# EAGLE design PRSC-2101-THCFS-1V3_eagle7 (EAGLE 9.5.0)
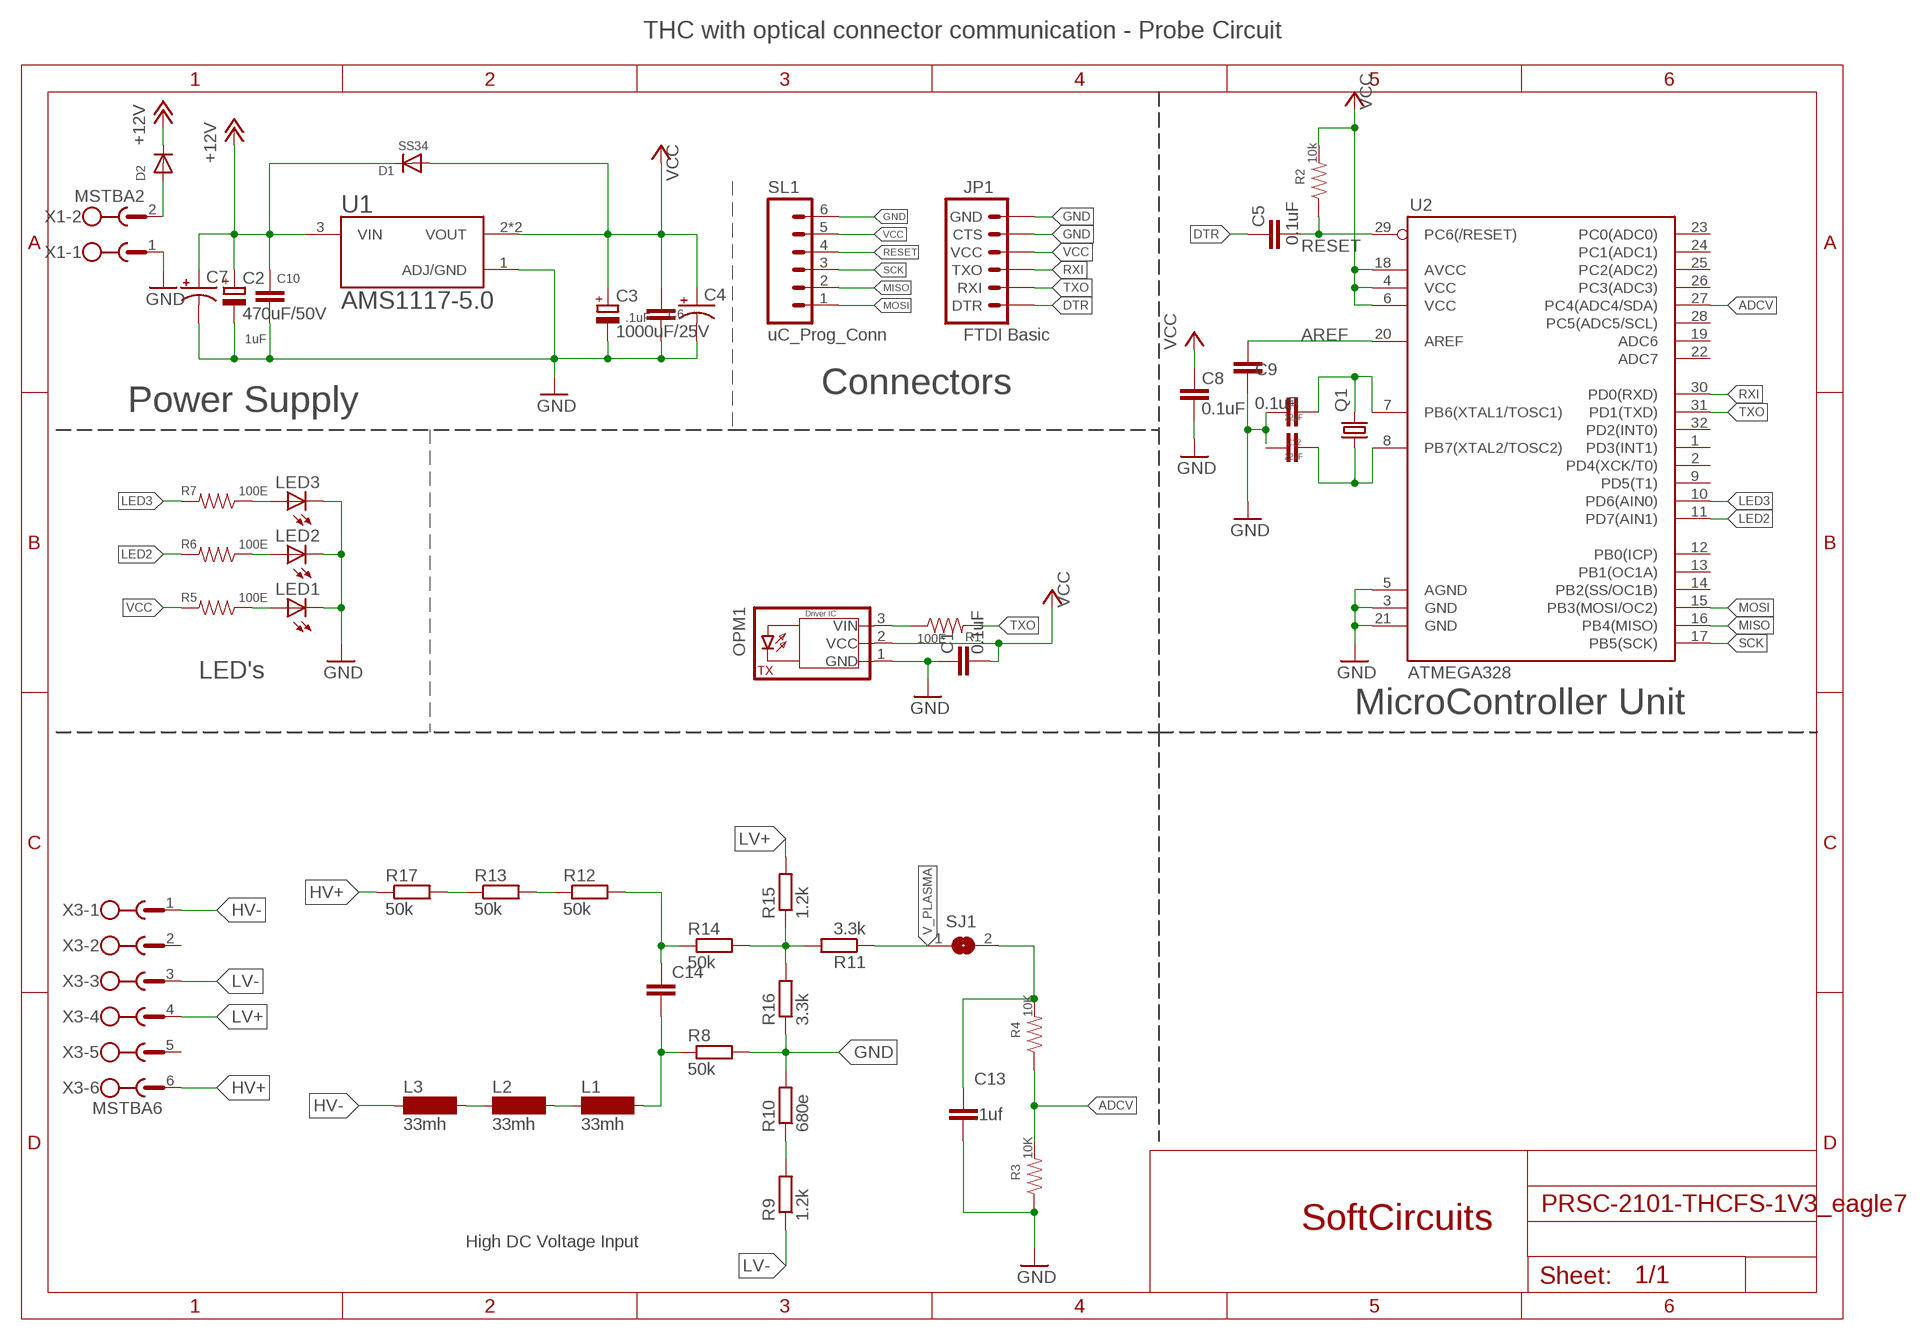
[diagram p0: schematic, sheet 1]

## Parts
C1  0.1uF  C-EUC1206  [C1206]
C2  470uF/50V  CPOL-EU153CLV-1010  [153CLV-1010]
C3  1000uF/25V  CPOL-EU153CLV-1010  [153CLV-1010]
C4  CAP_POL3528-KIT  [EIA3528-KIT]
C5  0.1uF  C-EUC1206  [C1206]
C6  .1uF  C-EUC1206  [C1206]
C7  CAP_POL3528-KIT  [EIA3528-KIT]
C8  0.1uF  C-EUC1206  [C1206]
C9  0.1uF  C-EUC1206  [C1206]
C10  1uF  C-EUC1206  [C1206]
C11  22pF  C-EUC1206  [C1206]
C12  22pF  C-EUC1206  [C1206]
C13  .1uf  C-EUC1206  [C1206]
C14  C-EU050-025X075  [C050-025X075]
D1  SS34  DIODESMA  [SMADIODE]
D2  DIODESMA  [SMADIODE]
JP1  FTDI Basic  ARDUINO_SERIAL_PROGRAMPTH  [1X06]
L1  33mh  SD12  [MY_INDUCTOR]
L2  33mh  SD12  [MY_INDUCTOR]
L3  33mh  SD12  [MY_INDUCTOR]
LED1  LED3MM  [LED3MM]
LED2  LED3MM  [LED3MM]
LED3  LED3MM  [LED3MM]
OPM1  TOSLINK_DQT-025  [TOSLINK_DQ-025]
Q1  CRYSTALHC49UP  [HC49UP]
R1  100E  RESISTOR1206  [1206]
R2  10k  RESISTOR1206  [1206]
R3  10K  RESISTOR1206  [1206]
R4  10K  RESISTOR1206  [1206]
R5  100E  RESISTOR1206  [1206]
R6  100E  RESISTOR1206  [1206]
R7  100E  RESISTOR1206  [1206]
R8  50k  R-EU_0207/5V  [0207/5V]
R9  1.2k  R-EU_0207/2V  [0207/2V]
R10  680e  R-EU_0207/5V  [0207/5V]
R11  3.3k  R-EU_0207/2V  [0207/2V]
R12  50k  R-EU_0207/5V  [0207/5V]
R13  50k  R-EU_0207/5V  [0207/5V]
R14  50k  R-EU_0207/5V  [0207/5V]
R15  1.2k  R-EU_0207/2V  [0207/2V]
R16  3.3k  R-EU_0207/15  [0207/15]
R17  50k  R-EU_0207/5V  [0207/5V]
SJ1  SJ  [SJ]
SL1  uC_Prog_Conn  M06  [06P]
U1  AMS1117-5.0  [SOT229P700X180-4N]
U2  ATMEGA328  ATMEGA168  [TQFP32-08]
X1  MSTBA2  [MSTBA2]
X3  MSTBA6  [MSTBA6]

## Nets
+12V [power]: C2.+ C7.A(+) C10.1 D1.C D2.C U1.3(VIN)
ADCV: R3.2 R4.1 U2.27(PC4(ADC4/SDA))
AREF: C9.2 U2.20(AREF)
DTR: C5.2 JP1.1(DTR)
GND: C1.2 C2.- C3.- C4.C(-) C6.2 C7.C(-) C8.1 C9.1 C10.2 C11.2 C12.2 C13.2 JP1.5(CTS) JP1.6(GND) LED1.K(C) LED2.K(C) LED3.K(C) OPM1.1(GND) R3.1 R8.2 R10.2 R16.1 SL1.6 U1.1(ADJ/GND) U2.3(GND) U2.5(AGND) U2.21(GND) X1.1
HV+: R17.1 X3.6
HV-: L3.1 X3.1
LED2: R6.2 U2.11(PD7(AIN1))
LED3: R7.2 U2.10(PD6(AIN0))
LV+: R15.2 X3.4
LV-: R9.1 X3.3
MISO: SL1.2 U2.16(PB4(MISO))
MOSI: SL1.1 U2.15(PB3(MOSI/OC2))
N$1: LED3.A R7.1
N$2: R13.1 R17.2
N$3: C14.1 R12.2 R14.1
N$4: L1.1 L2.2
N$5 [power]: D2.A X1.2
N$6: R12.1 R13.2
N$8: L2.1 L3.2
N$10: C14.2 L1.2 R8.1
N$11: OPM1.3(VIN) R1.1
N$13: R11.2 R14.2 R15.1 R16.2
N$16: C11.1 Q1.2 U2.7(PB6(XTAL1/TOSC1))
N$17: R9.2 R10.1
N$19: C12.1 Q1.1 U2.8(PB7(XTAL2/TOSC2))
N$22: LED2.A R6.1
N$23: LED1.A R5.1
PLASMA_VIN: C13.1 R4.2 SJ1.2
RESET: C5.1 R2.1 SL1.4 U2.29(PC6(/RESET))
RXI: JP1.3(TXO) U2.30(PD0(RXD))
SCK: SL1.3 U2.17(PB5(SCK))
TXO: JP1.2(RXI) R1.2 U2.31(PD1(TXD))
V_PLASMA: R11.1 SJ1.1
VCC: C1.1 C3.+ C4.A(+) C6.1 C8.2 D1.A JP1.4(VCC) OPM1.2(VCC) R2.2 R5.2 SL1.5 U1.2(VOUT) U1.4(VOUT) U2.4(VCC) U2.6(VCC) U2.18(AVCC)
Unconnected: U2.1(PD3(INT1)) U2.2(PD4(XCK/T0)) U2.9(PD5(T1)) U2.12(PB0(ICP)) U2.13(PB1(OC1A)) U2.14(PB2(SS/OC1B)) U2.19(ADC6) U2.22(ADC7) U2.23(PC0(ADC0)) U2.24(PC1(ADC1)) U2.25(PC2(ADC2)) U2.26(PC3(ADC3)) U2.28(PC5(ADC5/SCL)) U2.32(PD2(INT0)) X3.2 X3.5

## Notes on the sheet
- THC with optical connector communication - Probe Circuit
- Connectors
- Power Supply
- LED's
- MicroController Unit
- SoftCircuits
- High DC Voltage Input

## Library data of the parts
C1 C5 C6 C8-C13 = SoftCircuits-Capacitors:C-EU: CAPACITOR, European symbol; SPICEPREFIX: C
C2 C3 = SoftCircuits-Capacitors:CPOL-EU: POLARIZED CAPACITOR, European symbol; SPICEPREFIX: C
C4 C7 = SparkFun-Capacitors:CAP_POL: Capacitor Polarized These are standard SMD and PTH capacitors. Normally 10uF, 47uF, and 100uF in electrolytic and tantalum varieties. Always verify the external diameter of the through hole cap, it varies with capacity, voltage, and manufacturer. The EIA devices should be standard.
C14 = rcl:C-EU: CAPACITOR, European symbol
D1 D2 = adafruit:DIODE: Diode SMADIODE - SMA Surface Mount Package 20V 1A Schottky Diode Digikey: 641-1014-6-ND DO-1N4148 - Through Hole Small Current Diode SOD-123 20V 1 A (.5mV Vf) Schottky Diode - Digikey: MBRX120TPMSCT-ND SOD-323 10V 570mA (.38mV Vf, 3ns) Schottky Diode - Digikey: ZLLS410CT-ND SOD-523 30V 30mA Schottky Diode (RB751S-40TE61) - Digikey: RB751S-40TE61CT-ND SOT23-R/W - SOT23 Package (R = Solder Paste/Reflow Ovens, W = Hand-Soldering) BAT54Film 40V 300mA - Digikey: 497-7162-1-ND
JP1 = SparkFun:ARDUINO_SERIAL_PROGRAM
L1-L3 = inductor-neosid:SD12: INDUCTOR nominal inductance
LED1-LED3 = led:LED: LED OSRAM: - CHIPLED LG R971, LG N971, LY N971, LG Q971, LY Q971, LO R971, LY R971 LH N974, LH R974 LS Q976, LO Q976, LY Q976 LO Q996 - Hyper CHIPLED LW Q18S LB Q993, LB Q99A, LB R99A - SideLED LS A670, LO A670, LY A670, LG A670, LP A670 LB A673, LV A673, LT A673, LW A673 LH A674 LY A675 LS A676, LA A676, LO A676, LY A676, LW A676 LS A679, LY A679, LG A679 - Hyper Micro SIDELED® LS Y876, LA Y876, LO Y876, LY Y876 LT Y87S - SmartLED LW L88C, LW L88S LB L89C, LB L89S, LG L890 LS L89K, LO L89K, LY L89K LS L896, LA L896, LO L896, LY L896 - TOPLED LS T670, LO T670, LY T670, LG T670, LP T670 LSG T670, LSP T670, LSY T670, LOP T670, LYG T670 LG T671, LOG T671, LSG T671 LB T673, LV T673, LT T673, LW T673 LH T674 LS T676, LA T676, LO T676, LY T676, LB T676, LH T676, LSB T676, LW T676 LB T67C, LV T67C, LT T67C, LS T67K, LO T67K, LY T67K, LW E67C LS E67B, LA E67B, LO E67B, LY E67B, LB E67C, LV E67C, LT E67C LW T67C LS T679, LY T679, LG T679 LS T770, LO T770, LY T770, LG T770, LP T770 LB T773, LV T773, LT T773, LW T773 LH T774 LS E675, LA E675, LY E675, LS T675 LS T776, LA T776, LO T776, LY T776, LB T776 LHGB T686 LT T68C, LB T68C - Hyper Mini TOPLED® LB M676 - Mini TOPLED Santana® LG M470 LS M47K, LO M47K, LY M47K Source: http://www.osram.convergy.de LUXEON: - LUMILED® LXK2-PW12-R00, LXK2-PW12-S00, LXK2-PW14-U00, LXK2-PW14-V00 LXK2-PM12-R00, LXK2-PM12-S00, LXK2-PM14-U00 LXK2-PE12-Q00, LXK2-PE12-R00, LXK2-PE12-S00, LXK2-PE14-T00, LXK2-PE14-U00 LXK2-PB12-K00, LXK2-PB12-L00, LXK2-PB12-M00, LXK2-PB14-N00, LXK2-PB14-P00, LXK2-PB14-Q00 LXK2-PR12-L00, LXK2-PR12-M00, LXK2-PR14-Q00, LXK2-PR14-R00 LXK2-PD12-Q00, LXK2-PD12-R00, LXK2-PD12-S00 LXK2-PH12-R00, LXK2-PH12-S00 LXK2-PL12-P00, LXK2-PL12-Q00, LXK2-PL12-R00 Source: www.luxeon.com KINGBRIGHT: KA-3528ASYC Source: www.kingbright.com
OPM1 = TOSLINK_Optical-modules:TOSLINK_DQT-025: DQT-025 General Purpose optical transmitting module
Q1 = adafruit:CRYSTAL: CRYSTAL; OC_FARNELL: unknown; OC_NEWARK: unknown
R1-R7 = SoftCircuits-Resistors:RESISTOR: Resistor Basic schematic elements and footprints for 0603, 1206, and PTH resistors.
R8-R17 = resistor:R-EU_: RESISTOR, European symbol
SJ1 = jumper:SJ: SMD solder JUMPER
SL1 = con-amp-quick:M06: AMP QUICK CONNECTOR; OC_FARNELL: unknown; OC_NEWARK: unknown
U1 = AMS1117-5.0:AMS1117-5.0: Sot223/Pkg 1-Amp 5-Volt Low Drop Out Voltage Regulatator; AVAILABILITY: Unavailable; DESCRIPTION: Sot223/Pkg 1-Amp 5-Volt Low Drop Out Voltage Regulatator; MF: Advanced Monolithic Systems; MP: AMS1117-5.0; PACKAGE: None; PRICE: None
U2 = SparkFun:ATMEGA168
X1 = con-phoenix-508:MSTBA2: PHOENIX; MF: FARNELL; MPN: 1757242; OC_FARNELL: 3705171; OC_NEWARK: 71C4161
X3 = con-phoenix-508:MSTBA6: PHOENIX; MF: FARNELL; MPN: 1757284; OC_FARNELL: 3705213; OC_NEWARK: 71C4165

## Net classes
1 power: width 0.508 mm

## Board
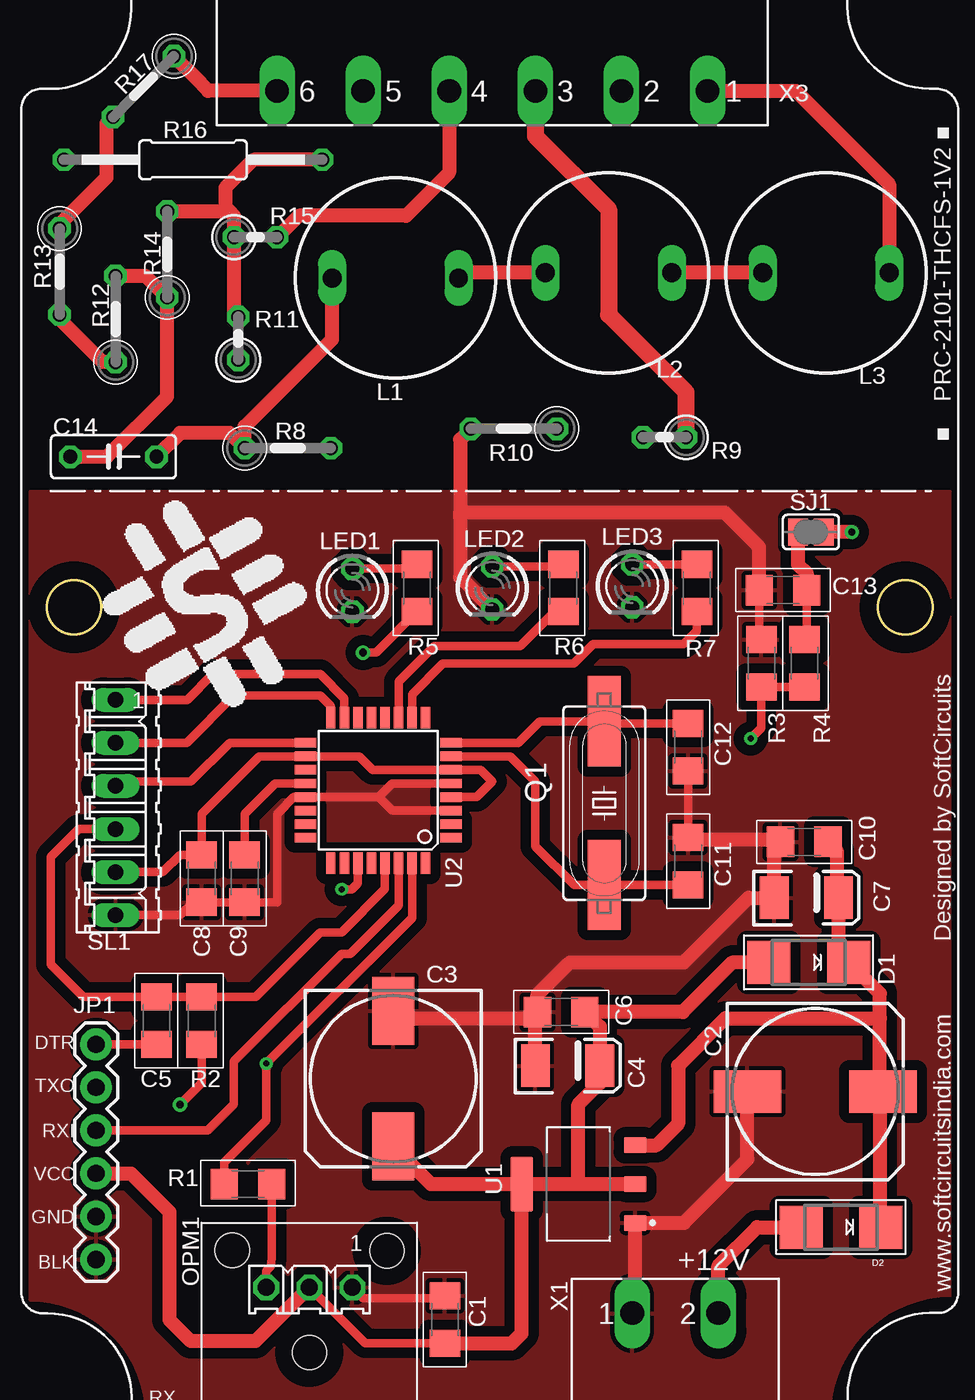
[diagram p1: board, top side]
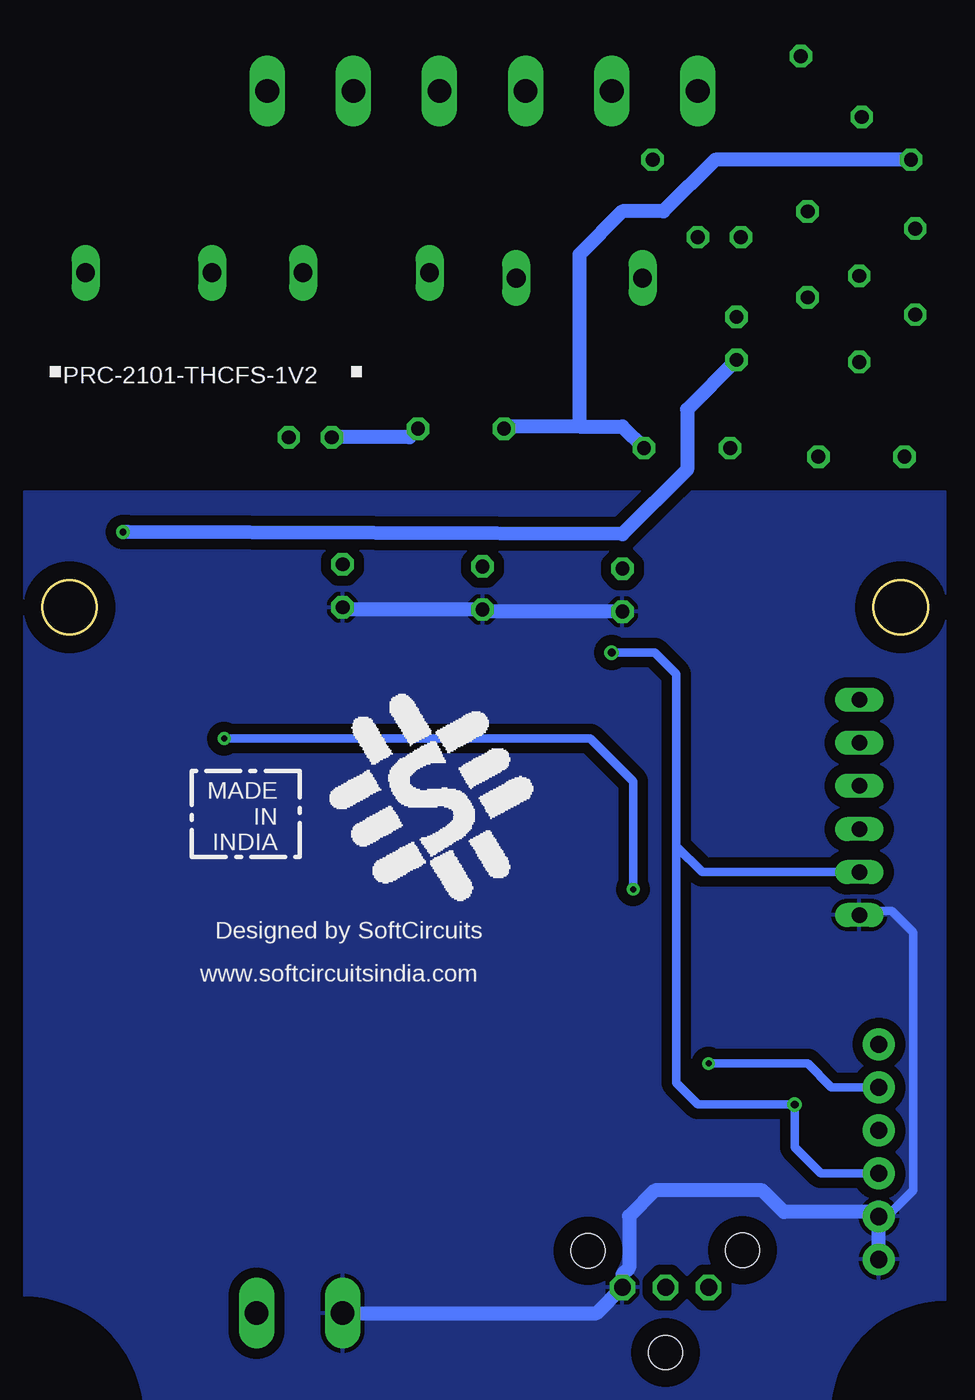
[diagram p2: board, bottom side, seen from below]

Size 52.25 x 3.2 mm. Coordinates in mm from the lower left corner, seen from the top.
Outline: circle at 1.6,1.6 radius 1.6
Outline: circle at 50.65,1.6 radius 1.6
Copper layers (1*16): Top 0.035mm / dielectric 1.5mm / Bottom 0.035mm
Design rules "default": minimum track width 6mil, minimum drill 0.35mm, track to track 6mil, track to pad 6mil, pad to pad 6mil, via to via 6mil, smd to smd 6mil, copper to edge 40mil, drill to drill 6mil, minimum pad ring 10mil, minimum via ring 8mil, stop-mask expansion 4mil, vias tented up to drill 0mil, thermal gap 10mil
Holes 3.2 mm at 1.6,1.6 50.65,1.6

### Footprints (pad centres in the part's own frame; a part is rotated, then mirrored left to right if it is on the bottom)
C1206 = smd 1.6 x 1.8: 1 -1.4,0; 2 1.4,0
153CLV-1010 = smd 4 x 2.5: + 4,0; - -4,0
EIA3528-KIT = smd 1.7 x 2.5: A 1.9,0; C -1.9,0
C050-025X075 = drill 0.813 octagon: 1 -2.54,0; 2 2.54,0
SMADIODE = smd 2.54 x 2.54: A 2.349,0; C -2.349,0
1X06 = drill 1.016 pad 1.88: 1 0,0; 2 2.54,0; 3 5.08,0; 4 7.62,0; 5 10.16,0; 6 12.7,0
MY_INDUCTOR = drill 1.1 long: 1 -3.73,0; 2 3.73,0
LED3MM = drill 0.813 octagon: A -1.27,0; K 1.27,0
TOSLINK_DQ-025 = drill 1 octagon: 1 2.54,6.35; 2 0,6.35; 3 -2.54,6.35 | hole 2: -4.547,8.534; 4.572,8.509; 0,2.515
HC49UP = smd 5.334 x 1.93: 1 -4.826,0; 2 4.826,0
1206 = smd 1.6 x 1.8: 1 -1.4,0; 2 1.4,0
0207/5V = drill 0.813 octagon: 1 -2.54,0; 2 2.54,0
0207/2V = drill 0.813 octagon: 1 -1.27,0; 2 1.27,0
0207/15 = drill 0.813 octagon: 1 -7.62,0; 2 7.62,0
SJ = smd 1.168 x 1.6: 1 -0.762,0; 2 0.762,0
06P = drill 0.914 long: 1 -6.35,0; 2 -3.81,0; 3 -1.27,0; 4 1.27,0; 5 3.81,0; 6 6.35,0
SOT229P700X180-4N = smd 0.93 x 1.31: 1 -2.29,-3.345; 2 0,-3.345; 3 2.29,-3.345 | smd 3.24 x 1.31: 4 0,3.345
TQFP32-08 = smd 1.27 x 0.559: 1 -4.293,2.8; 2 -4.293,2; 3 -4.293,1.2; 4 -4.293,0.4; 5 -4.293,-0.4; 6 -4.293,-1.2; 7 -4.293,-2; 8 -4.293,-2.8; 17 4.293,-2.8; 18 4.293,-2; 19 4.293,-1.2; 20 4.293,-0.4; 21 4.293,0.4; 22 4.293,1.2; 23 4.293,2; 24 4.293,2.8 | smd 0.559 x 1.27: 9 -2.8,-4.293; 10 -2,-4.293; 11 -1.2,-4.293; 12 -0.4,-4.293; 13 0.4,-4.293; 14 1.2,-4.293; 15 2,-4.293; 16 2.8,-4.293; 25 2.8,4.293; 26 2,4.293; 27 1.2,4.293; 28 0.4,4.293; 29 -0.4,4.293; 30 -1.2,4.293; 31 -2,4.293; 32 -2.8,4.293
MSTBA2 = drill 1.397 long: 1 -2.54,5.08; 2 2.54,5.08
MSTBA6 = drill 1.397 long: 1 -12.7,5.08; 2 -7.62,5.08; 3 -2.54,5.08; 4 2.54,5.08; 5 7.62,5.08; 6 12.7,5.08

### Placement (x,y rotation side)
C1  23.49,-40.44 90 top  (outside the outline)
C2  45.33,-26.97 0 top  (outside the outline)
C3  20.44,-26.21 270 top  (outside the outline)
C4  30.72,-25.45 0 top  (outside the outline)
C5  6.47,-22.78 270 top  (outside the outline)
C6  30.34,-22.28 180 top  (outside the outline)
C7  44.81,-15.54 0 top  (outside the outline)
C8  9.13,-14.4 90 top  (outside the outline)
C9  11.67,-14.4 90 top  (outside the outline)
C10  44.68,-12.24 180 top  (outside the outline)
C11  37.84,-13.39 90 top  (outside the outline)
C12  37.84,-6.66 270 top  (outside the outline)
C13  43.43,2.62 180 top
C14  3.93,10.49 0 top  (outside the outline)
D1  44.95,-19.36 180 top  (outside the outline)
D2  46.85,-34.98 180 top  (outside the outline)
JP1  2.9,-24.19 270 top  (outside the outline)
L1  20.56,21.03 180 top  (outside the outline)
L2  33.14,21.35 180 top  (outside the outline)
L3  45.96,21.35 180 top  (outside the outline)
LED1  18.02,2.62 270 top
LED2  26.28,2.74 270 top
LED3  34.53,2.87 270 top
LOGO1  [SC_LOGO]  9.78,2.11 180 top
LOGO100  [SC_LOGO]  28.83,-9.32 180 bottom  (outside the outline)
OPM1  15.48,-44.88 0 top  (outside the outline)
Q1  32.88,-9.96 270 top  (outside the outline)
R1  11.86,-32.44 180 top  (outside the outline)
R2  9.13,-22.78 270 top  (outside the outline)
R3  42.15,-1.7 270 top
R4  44.69,-1.7 90 top
R5  21.83,2.74 270 top
R6  30.47,2.74 270 top
R7  38.34,2.74 270 top
R8  14.21,11 0 top  (outside the outline)
R9  36.44,11.63 180 top  (outside the outline)
R10  27.55,12.14 180 top  (outside the outline)
R11  11.29,17.48 90 top  (outside the outline)
R12  4.05,18.62 90 top  (outside the outline)
R13  0.75,21.41 270 top  (outside the outline)
R14  7.1,22.43 90 top  (outside the outline)
R15  12.31,23.44 0 top  (outside the outline)
R16  8.63,28.02 0 top  (outside the outline)
R17  5.71,32.33 225 top  (outside the outline)
SJ1  45.08,6.05 180 top
SL1  4.05,-10.21 270 top  (outside the outline)
U1  31.36,-32.44 90 top  (outside the outline)
U2  19.55,-9.2 180 top  (outside the outline)
X1  37.07,-45.14 0 top  (outside the outline)
X3  26.28,37.16 180 top  (outside the outline)

### Tracks (layer width: path | path; a pad name or v marks a point on that pad's centre or on a via)
+12V
  Top 0.813: C2.+ 49.14,-26.79 | 49.14,-26.79 49.14,-22.66 | 49.14,-22.66 49.14,-21.2 D1.C 46.71,-18.77 C7.A 46.6,-15.44 46.6,-12.76 C10.1 | U1.3 35.97,-30.15 37.24,-28.88 37.24,-25.45 40.03,-22.66 49.14,-22.66 | 49.14,-26.79 49.14,-34.91 D2.C
ADCV  (via drill 0.35)
  Top 0.508: R4.1 R3.2 42.15,-5.51 v41.52,-6.15 | U2.27 18.35,-14.69 18,-15.04 v17.39,-15.04
  Bottom 0.508: v41.52,-6.15 19.93,-6.15 17.39,-8.69 v17.39,-15.04
AREF
  Top 0.508: C9.2 11.67,-10.59 13.47,-8.8 U2.20
DTR
  Top 0.508: C5.2 JP1.1
GND
  Top 0.508: C13.2 42.03,-0.17 R3.1 | 9.26,-15.8 C8.1 | C8.1 8.62,-15.8 7.86,-16.56 SL1.6 | C12.2 C11.2 37.84,-12.12 | C8.1 C9.1 13.58,-15.8 13.58,-10.58 14.57,-9.59 U2.21 19.57,-9.59 | OPM1.1 18.66,-39.17 23.36,-39.17 C1.2 | U2.3 20.37,-10.39 19.57,-9.59 | U2.5 20.37,-8.8 19.57,-9.59
  Top 0.813: R10.2 24.37,11.51 24.37,7.19 40,7.19 42.03,5.16 C13.2 | 24.37,6.93 24.37,3.38 LED2.K | X1.1 34.7,-39.89 U1.1 37.58,-34.73 41.33,-30.98 C2.- | C3.- 20.88,-22.66 28.82,-22.66 C4.C | 28.82,-22.66 28.94,-22.54 C6.2 28.94,-21.26 30.85,-19.36 37.57,-19.36 41.38,-15.54 C7.C 42.91,-12.62 C10.2 43.28,-12.12 37.84,-12.12
  Bottom 0.508: JP1.5 2.41,-34.35 0.88,-32.82 0.88,-17.58 2.15,-16.31 3.8,-16.31 SL1.6
  Bottom 0.813: R16.1 12.56,28.02 15.61,24.97 18.02,24.97 20.56,22.43 20.56,12.27 | R10.2 24.88,12.27 20.56,12.27 | 20.56,12.27 18.02,12.27 R8.2 | LED1.K 26.15,1.35 LED2.K 34.41,1.47 LED3.K | X1.1 19.55,-40.06 OPM1.1 18.02,-37.77 17.63,-37.38 17.63,-34.33 16.12,-32.82 9.77,-32.82 8.5,-34.09 3.17,-34.09 JP1.5 JP1.6
  pour Bottom (isolate 0.61): -1.03,8.46 -1.03,-39.29 arc-90 5.83,-46.15 46.22,-46.15 arc-90 53.33,-39.04 53.33,8.46
  pour Top (isolate 0.61): -1.03,8.46 -1.03,-39.29 arc-90 5.83,-46.15 46.22,-46.15 arc-90 53.33,-39.04 53.33,8.46
HV+
  Top 0.813: X3.6 9.52,32.08 9.53,32.1 8.77,32.86 | 8.77,32.86 | 8.77,32.86 R17.1
HV-
  Top 0.813: X3.1 44.19,32.08 49.69,26.57 L3.1
LED2
  Top 0.508: R6.2 29.96,1.34 27.93,-0.69 22.85,-0.69 20.75,-2.79 U2.11
LED3
  Top 0.508: U2.10 21.55,-3.54 23.36,-1.73 31.08,-1.73 32.25,-0.56 37.58,-0.56 38.34,0.2 R7.2
LV+
  Top 0.813: X3.4 23.74,27.25 21.2,24.71 14.85,24.71 R15.2
LV-
  Top 1.016: X3.3 28.82,29.41 33.14,25.1 33.14,18.87 37.71,14.3 R9.1
MISO
  Top 0.508: U2.16 16.75,-4.24 16.12,-3.61 11.04,-3.61 8.25,-6.4 SL1.2
MOSI
  Top 0.508: SL1.1 8.28,-3.86 9.8,-2.34 16.12,-2.34 17.55,-3.77 U2.15
N$1
  Top 0.508: LED3.A R7.1
N$2
  Top 0.813: R13.1 0.75,24.21 3.53,26.98 3.53,30.16 R17.2
N$3
  Top 0.813: R12.2 5.83,21.16 R14.1 7.1,14.05 3.55,10.49 C14.1
N$4
  Top 0.813: L2.2 24.61,21.35 L1.1
N$5
  Top 0.813: X1.2 39.61,-37.26 41.9,-34.98 D2.A
N$6
  Top 0.813: R12.1 3.29,16.08 0.75,18.62 R13.2
N$8
  Top 0.813: L3.2 L2.1
N$10
  Top 0.813: C14.2 7.86,11.89 10.79,11.89 R8.1 11.67,12.27 16.83,17.43 L1.2
N$11
  Top 0.508: R1.1 13.26,-36.8 13.21,-37.29 12.94,-37.55 OPM1.3
N$13
  Top 0.813: R16.2 12.18,28.02 10.53,26.37 10.53,25.22 10.79,24.97 | 10.79,24.97 11.04,24.71 R15.1 11.04,19 R11.2 | R14.2 10.79,24.97
N$14
  cutout Bottom: 33.26,16.71 51.64,16.71 51.64,14.17 33.26,14.17
N$16
  Top 0.508: C11.1 35.17,-14.79 35.17,-14.78 Q1.2 31.11,-14.78 28.82,-12.5 28.82,-8.69 27.33,-7.2 U2.7
N$17
  Bottom 0.813: R10.1 30.6,11.63 R9.2
N$19
  Top 0.508: C12.1 33.01,-5.26 Q1.1 29.07,-5.13 27.81,-6.39 U2.8
N$22
  Top 0.508: LED2.A 30.34,4.01 R6.1
N$23
  Top 0.508: LED1.A 21.58,3.89 R5.1
PLASMA_VIN
  Top 0.508: C13.1 44.83,-0.17 R4.2
  Top 0.813: SJ1.2 44.31,4.14 44.83,3.63 C13.1
RESET
  Top 0.508: SL1.4 1.9,-11.48 0.24,-13.13 0.24,-19.48 2.15,-21.38 C5.1 R2.1 12.31,-21.38 16.12,-17.58 17.39,-17.58 19.95,-15.02 U2.29
RXI
  Top 0.508: U2.30 20.75,-16 17.9,-18.85 17.39,-18.85 11.04,-25.2 11.04,-27.74 9.51,-29.27 JP1.3
SCK
  Top 0.508: SL1.3 4.31,-8.69 8.5,-8.69 10.79,-6.39 U2.17
TXO  (via drill 0.35)
  Top 0.508: U2.31 21.55,-16.72 v12.94,-25.32 12.94,-28.69 10.47,-31.17 R1.2
  Bottom 0.508: v12.94,-25.32 7.1,-25.32 5.7,-26.73 JP1.2
V_PLASMA  (via drill 0.4)
  Top 0.813: v47.49,6.05 45.88,6.05 SJ1.1
  Bottom 0.813: R11.1 14.21,13.28 14.21,9.73 18.02,5.92 47.23,6.05 v47.49,6.05
VCC  (via drill 0.45)
  Top 0.508: SL1.5 6.85,-14.02 7.86,-13 C8.2 9.13,-10.59 12.53,-7.2 U2.18 18.44,-7.2 19.24,-7.99 U2.6 25.59,-7.99 26.28,-8.69 25.37,-9.59 U2.4 | C1.1 18.79,-41.84 OPM1.2 | R2.2 9.13,-26.47 v7.86,-27.74 | R5.2 19.42,-1.07 v18.66,-1.07
  Top 0.813: U1.4 31.36,-32.44 | 31.36,-32.44 U1.2 | C3.+ 22.66,-32.44 U1.4 | 31.36,-32.44 31.36,-27.74 32.62,-26.47 C4.A 32.62,-23.16 C6.1 37.52,-22.28 40.44,-19.36 D1.A | C1.1 27.42,-41.84 28.01,-41.24 U1.4 | OPM1.2 12.31,-41.71 8.5,-41.71 7.23,-40.44 7.23,-34.09 4.95,-31.81 JP1.4
  Bottom 0.508: JP1.4 6.33,-31.81 7.86,-30.28 v7.86,-27.74 13.58,-27.74 14.85,-26.47 14.85,-12.5 | v18.66,-1.07 16.12,-1.07 14.85,-2.34 14.85,-12.5 | 14.85,-12.5 13.33,-14.02 SL1.5

### Text on the board
tPlace: PRC-2101-THCFS-1V2 | Designed by SoftCircuits | www.softcircuitsindia.com | DTR | TXO | RXI | VCC | GND | BLK | +12V | RX
bPlace: PRC-2101-THCFS-1V2 | MADE / IN / INDIA | Designed by SoftCircuits | www.softcircuitsindia.com
_tNames: R17 | X3 | R16 | R15 | R14 | R13 | R12 | R11 | L2 | L3 | L1 | C14 | R8 | R10 | R9 | SJ1 | LED1 | LED2 | LED3 | C13 | R5 | R6 | R7 | C12 | R3 | R4 | Q1 | C10 | C11 | U2 | C7 | C8 | C9 | SL1 | D1 | C3 | C6 | JP1 | C4 | C2 | C5 | R2 | R1 | U1 | D2 | OPM1 | C1 | X1